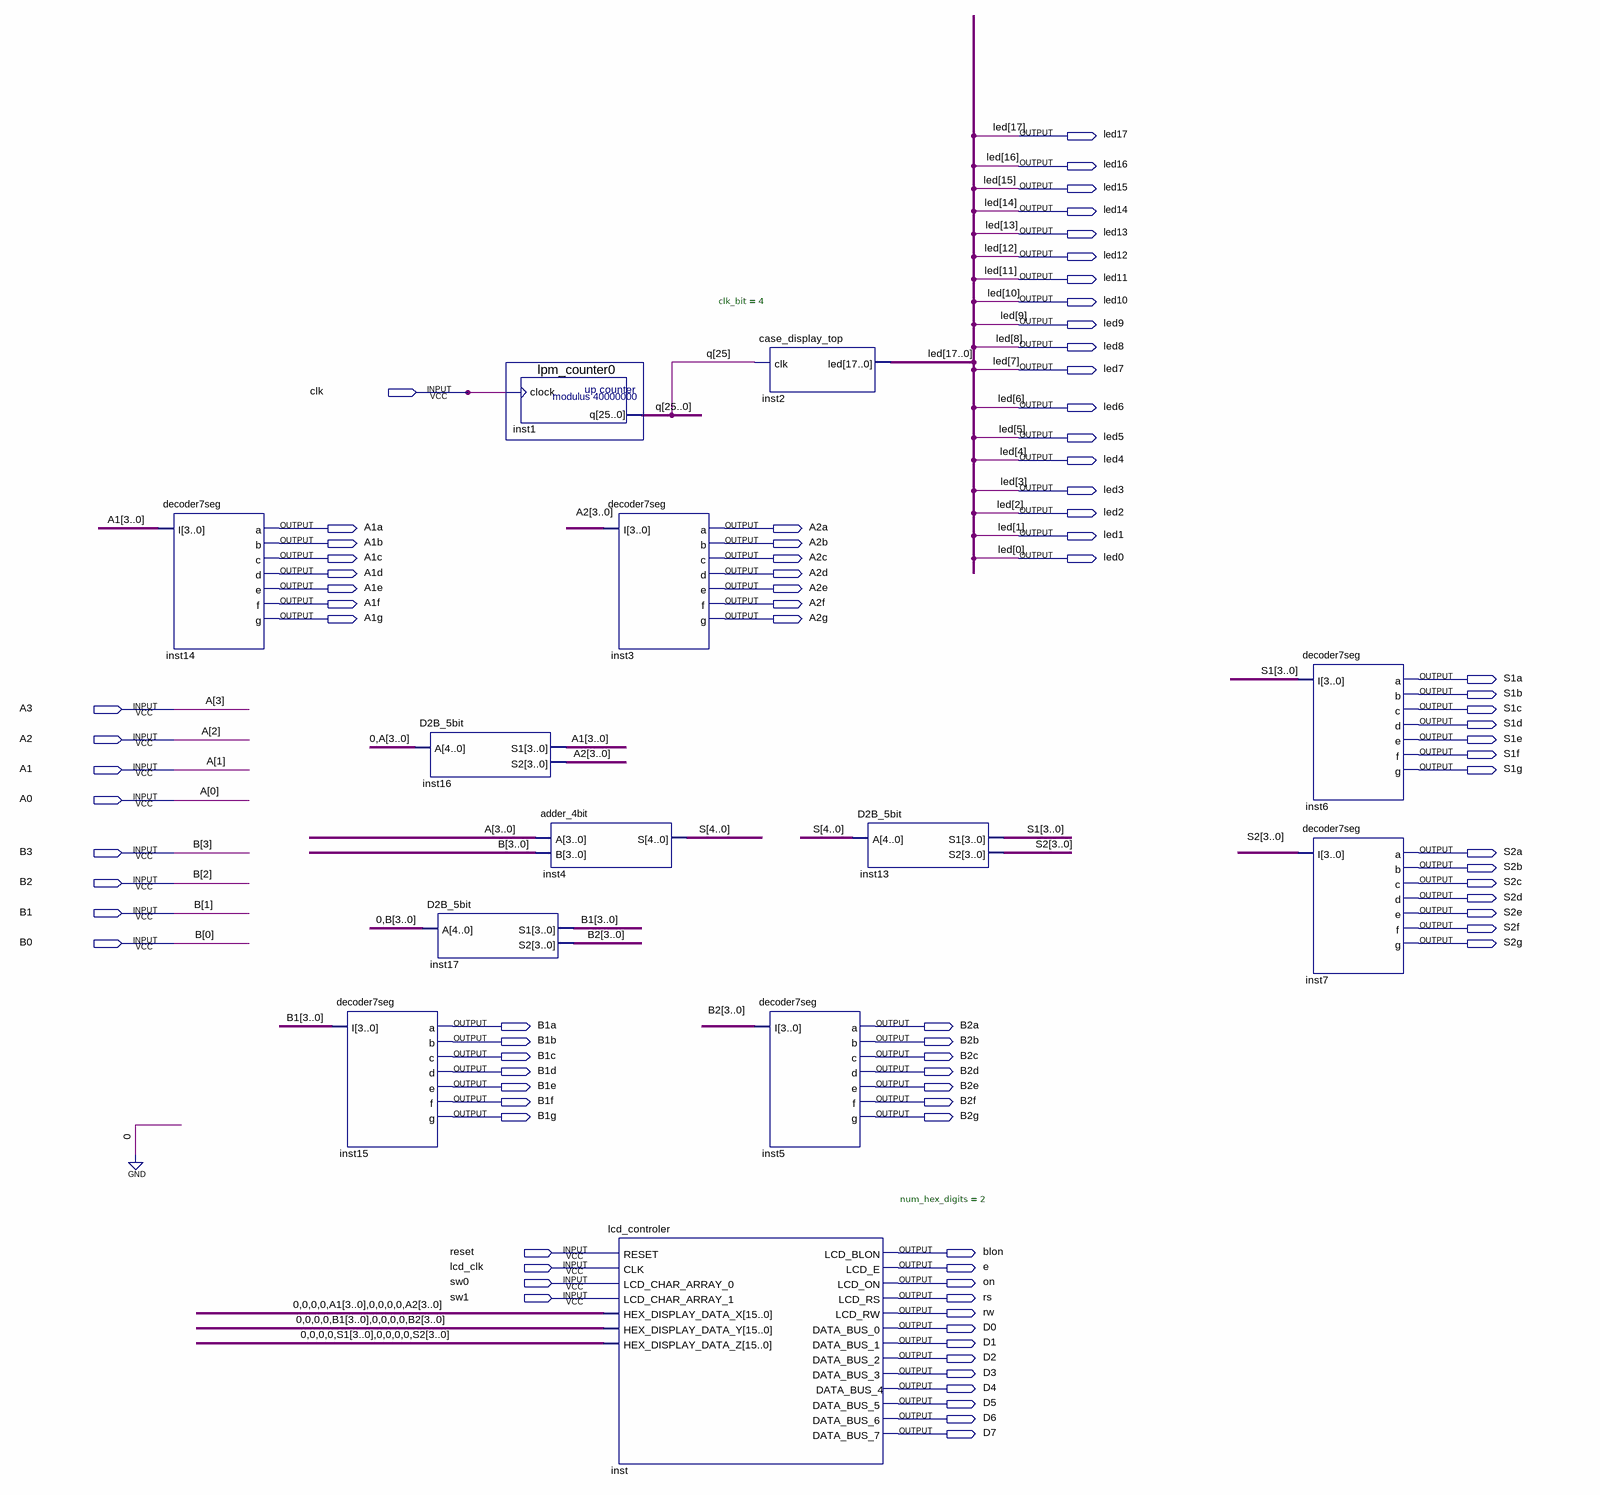
[diagram p0: schematic sheet]
// Quartus schematic Block1.bdf as structural Verilog: 13 symbols, 86 pins
module Block1 (
  input  clk,
  input  A3,
  input  A2,
  input  A1,
  input  A0,
  input  B3,
  input  B2,
  input  B1,
  input  B0,
  input  reset,
  input  lcd_clk,
  input  sw0,
  input  sw1,
  output led17,
  output led16,
  output led15,
  output led14,
  output led13,
  output led12,
  output led11,
  output led10,
  output led9,
  output led8,
  output led7,
  output led6,
  output led5,
  output led4,
  output led3,
  output led2,
  output A1a,
  output A2a,
  output led1,
  output A1b,
  output A2b,
  output A1c,
  output A2c,
  output led0,
  output A1d,
  output A2d,
  output A1e,
  output A2e,
  output A1f,
  output A2f,
  output A1g,
  output A2g,
  output S1a,
  output S1b,
  output S1c,
  output S1d,
  output S1e,
  output S1f,
  output S1g,
  output S2a,
  output S2b,
  output S2c,
  output S2d,
  output S2e,
  output S2f,
  output S2g,
  output B1a,
  output B2a,
  output B1b,
  output B2b,
  output B1c,
  output B2c,
  output B1d,
  output B2d,
  output B1e,
  output B2e,
  output B1f,
  output B2f,
  output B1g,
  output B2g,
  output blon,
  output e,
  output on,
  output rs,
  output rw,
  output D0,
  output D1,
  output D2,
  output D3,
  output D4,
  output D5,
  output D6,
  output D7
);

  wire [3:0] A1_bus, A2_bus, B1_bus, B2_bus, S1, S2;
  wire [4:0] S;
  wire [25:0] q;

  decoder7seg inst14 (.I(A1_bus), .a(A1a), .b(A1b), .c(A1c), .d(A1d), .e(A1e), .f(A1f), .g(A1g));
  decoder7seg inst15 (.I(B1_bus), .a(B1a), .b(B1b), .c(B1c), .d(B1d), .e(B1e), .f(B1f), .g(B1g));
  D2B_5bit inst16 (.A({1'b0, A3, A2, A1, A0}), .S1(A1_bus), .S2(A2_bus));
  D2B_5bit inst17 (.A({1'b0, B3, B2, B1, B0}), .S1(B1_bus), .S2(B2_bus));
  lpm_counter0 inst1 (.clock(clk), .q(q));
  adder_4bit inst4 (.A({A3, A2, A1, A0}), .B({B3, B2, B1, B0}), .S(S));
  decoder7seg inst3 (.I(A2_bus), .a(A2a), .b(A2b), .c(A2c), .d(A2d), .e(A2e), .f(A2f), .g(A2g));
  lcd_controler #(.num_hex_digits(2)) inst (
    .RESET(reset), .CLK(lcd_clk), .LCD_CHAR_ARRAY_0(sw0), .LCD_CHAR_ARRAY_1(sw1),
    .HEX_DISPLAY_DATA_X({4'b0000, A1_bus, 4'b0000, A2_bus}),
    .HEX_DISPLAY_DATA_Y({4'b0000, B1_bus, 4'b0000, B2_bus}), .HEX_DISPLAY_DATA_Z({4'b0000, S1, 4'b0000, S2}),
    .LCD_BLON(blon), .LCD_E(e), .LCD_ON(on), .LCD_RS(rs), .LCD_RW(rw), .DATA_BUS_0(D0), .DATA_BUS_1(D1),
    .DATA_BUS_2(D2), .DATA_BUS_3(D3), .DATA_BUS_4(D4), .DATA_BUS_5(D5), .DATA_BUS_6(D6), .DATA_BUS_7(D7));
  case_display_top #(.clk_bit(4)) inst2 (
    .clk(q[25]),
    .led({led17, led16, led15, led14, led13, led12, led11, led10, led9, led8, led7, led6, led5, led4, led3, led2, led1, led0}));
  decoder7seg inst5 (.I(B2_bus), .a(B2a), .b(B2b), .c(B2c), .d(B2d), .e(B2e), .f(B2f), .g(B2g));
  D2B_5bit inst13 (.A(S), .S1(S1), .S2(S2));
  decoder7seg inst6 (.I(S1), .a(S1a), .b(S1b), .c(S1c), .d(S1d), .e(S1e), .f(S1f), .g(S1g));
  decoder7seg inst7 (.I(S2), .a(S2a), .b(S2b), .c(S2c), .d(S2d), .e(S2e), .f(S2f), .g(S2g));
endmodule
